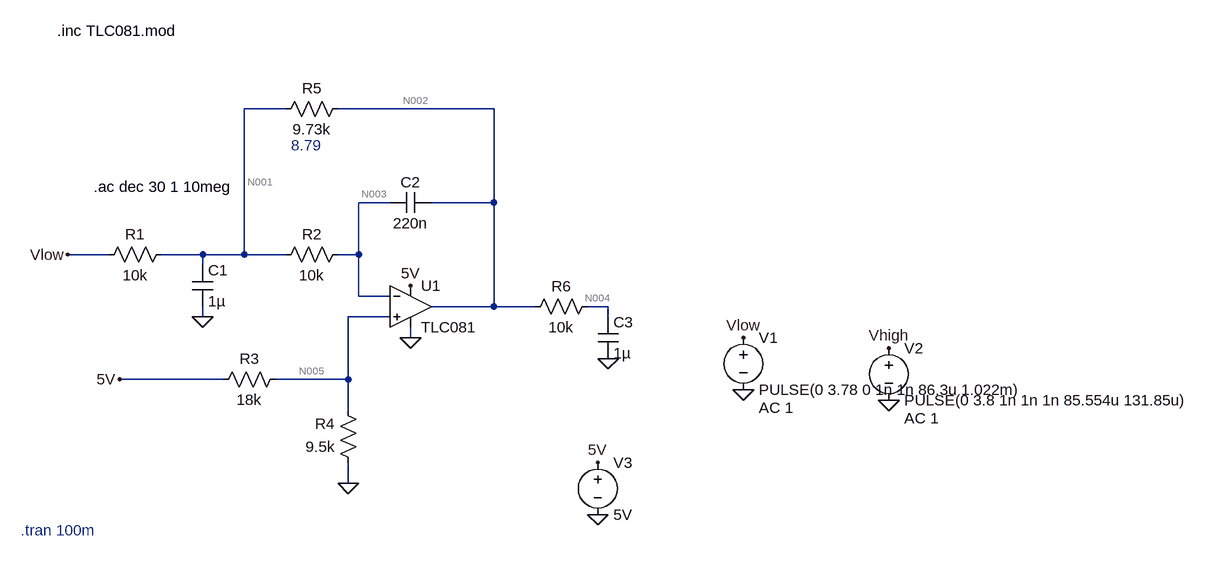
[diagram p0: schematic MFB.asc]
MFB.asc, the LTspice schematic file:
Version 4.1
SHEET 1 1692 680
WIRE 272 -112 208 -112
WIRE 592 -112 352 -112
WIRE 432 32 384 32
WIRE 592 32 592 -112
WIRE 592 32 496 32
WIRE 0 112 -64 112
WIRE 144 112 80 112
WIRE 208 112 208 -112
WIRE 208 112 144 112
WIRE 272 112 208 112
WIRE 384 112 384 32
WIRE 384 112 352 112
WIRE 144 128 144 112
WIRE 384 176 384 112
WIRE 432 176 384 176
WIRE 592 192 592 32
WIRE 592 192 496 192
WIRE 656 192 592 192
WIRE 768 192 736 192
WIRE 144 208 144 192
WIRE 432 208 368 208
WIRE 768 208 768 192
WIRE 464 240 464 224
WIRE 176 304 16 304
WIRE 368 304 368 208
WIRE 368 304 256 304
WIRE 368 352 368 304
WIRE 368 464 368 432
FLAG -64 112 Vlow
FLAG 16 304 5V
FLAG 368 464 0
FLAG 144 208 0
FLAG 976 320 0
FLAG 1200 336 0
FLAG 976 240 Vlow
FLAG 1200 256 Vhigh
FLAG 752 432 5V
FLAG 752 512 0
FLAG 464 160 5V
FLAG 464 240 0
FLAG 768 272 0
SYMBOL res 96 96 R90
WINDOW 0 0 56 VBottom 2
WINDOW 3 32 56 VTop 2
SYMATTR InstName R1
SYMATTR Value 10k
SYMBOL res 368 96 R90
WINDOW 0 0 56 VBottom 2
WINDOW 3 32 56 VTop 2
SYMATTR InstName R2
SYMATTR Value 10k
SYMBOL res 272 288 R90
WINDOW 0 0 56 VBottom 2
WINDOW 3 32 56 VTop 2
SYMATTR InstName R3
SYMATTR Value 18k
SYMBOL res 384 448 R180
WINDOW 0 36 76 Left 2
WINDOW 3 36 40 Left 2
SYMATTR InstName R4
SYMATTR Value 9.5k
SYMBOL res 256 -96 R270
WINDOW 0 32 56 VTop 2
WINDOW 3 0 56 VBottom 2
SYMATTR InstName R5
SYMATTR Value 9.73k
SYMBOL OpAmps\\opamp2 464 128 R0
SYMATTR InstName U1
SYMATTR Value TLC081
SYMBOL cap 128 128 R0
SYMATTR InstName C1
SYMATTR Value 1µ
SYMBOL voltage 976 224 R0
WINDOW 123 24 124 Left 2
WINDOW 39 0 0 Left 0
SYMATTR InstName V1
SYMATTR Value PULSE(0 3.78 0 1n 1n 86.3u 1.022m)
SYMATTR Value2 AC 1
SYMBOL voltage 1200 240 R0
WINDOW 123 24 124 Left 2
WINDOW 39 0 0 Left 0
SYMATTR InstName V2
SYMATTR Value PULSE(0 3.8 1n 1n 1n 85.554u 131.85u)
SYMATTR Value2 AC 1
SYMBOL voltage 752 416 R0
WINDOW 123 0 0 Left 0
WINDOW 39 0 0 Left 0
SYMATTR InstName V3
SYMATTR Value 5V
SYMBOL cap 496 16 R90
WINDOW 0 0 32 VBottom 2
WINDOW 3 32 32 VTop 2
SYMATTR InstName C2
SYMATTR Value 220n
SYMBOL res 752 176 R90
WINDOW 0 0 56 VBottom 2
WINDOW 3 32 56 VTop 2
SYMATTR InstName R6
SYMATTR Value 10k
SYMBOL cap 752 208 R0
SYMATTR InstName C3
SYMATTR Value 1µ
TEXT -80 -232 Left 2 !.inc TLC081.mod
TEXT -136 536 Left 2 ;.tran 100m
TEXT 280 -56 Left 2 ;8.79
TEXT -24 8 Left 2 !.ac dec 30 1 10meg

The netlist it stands for:
* MFB.asc
R1 N001 Vlow 10k
R2 N003 N001 10k
R3 N005 5V 18k
R4 0 N005 9.5k
R5 N001 N002 9.73k
X§U1 N005 N003 5V 0 N002 TLC081  ; pins In+ In- V+ V- OUT
C1 N001 0 1µ
V1 Vlow 0 PULSE(0 3.78 0 1n 1n 86.3u 1.022m) AC 1
V2 Vhigh 0 PULSE(0 3.8 1n 1n 1n 85.554u 131.85u) AC 1
V3 5V 0 5V
C2 N002 N003 220n
R6 N004 N002 10k
C3 N004 0 1µ
.inc TLC081.mod
* .tran 100m
* 8.79
.ac dec 30 1 10meg
.backanno
.end

* Results of the author's LTspice run, read from the files saved beside the schematic
* Operating Point, zero values left out:
*   V(5v) = 5 V
*   V(n001) = 1.729 V
*   V(n002) = 3.41 V
*   V(n003) = 1.729 V
*   V(n004) = 3.41 V
*   V(n005) = 1.727 V
*   I(R1) = 172.9 µA
*   I(R2) = -2.361 pA
*   I(R3) = -181.8 µA
*   I(R4) = -181.8 µA
*   I(R5) = -172.9 µA
*   I(V1) = 172.9 µA
*   I(V3) = -1.138 mA
*   Ix(u1:1) = 2.356 pA
*   Ix(u1:2) = 2.361 pA
*   Ix(u1:3) = 955.7 µA
*   Ix(u1:4) = -956.8 µA
*   Ix(u1:5) = -172.9 µA
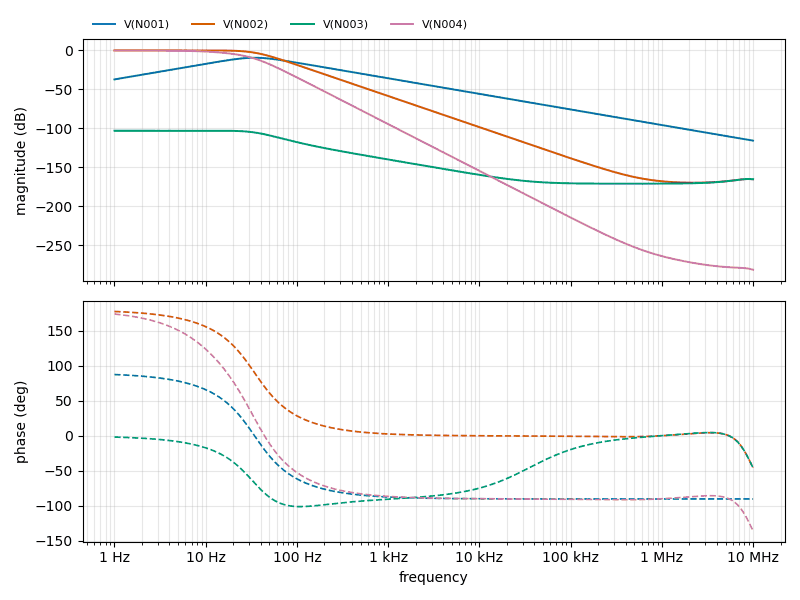
[diagram p1: AC Analysis of MFB.asc, plotted from the saved traces]
* AC Analysis, 1 run:
*   V(N001): -37.43 dB at 1 Hz, -115.96 dB at 10 MHz, peak -9.62 dB at 34.15 Hz, 3 dB below the peak at 17.91 Hz and 66.07 Hz
*   V(N002): -0.24 dB at 1 Hz, -165.50 dB at 10 MHz, peak -0.24 dB at 4.642 Hz, 3 dB below the peak at 34.69 Hz
*   V(N003): -103.27 dB at 1 Hz, -165.51 dB at 10 MHz, peak -103.21 dB at 11.66 Hz, 3 dB below the peak at 37.63 Hz
*   V(N004): -0.25 dB at 1 Hz, -281.46 dB at 10 MHz, peak -0.25 dB at 1 Hz, 3 dB below the peak at 15.44 Hz